# EAGLE design shema (EAGLE 9.6.2)
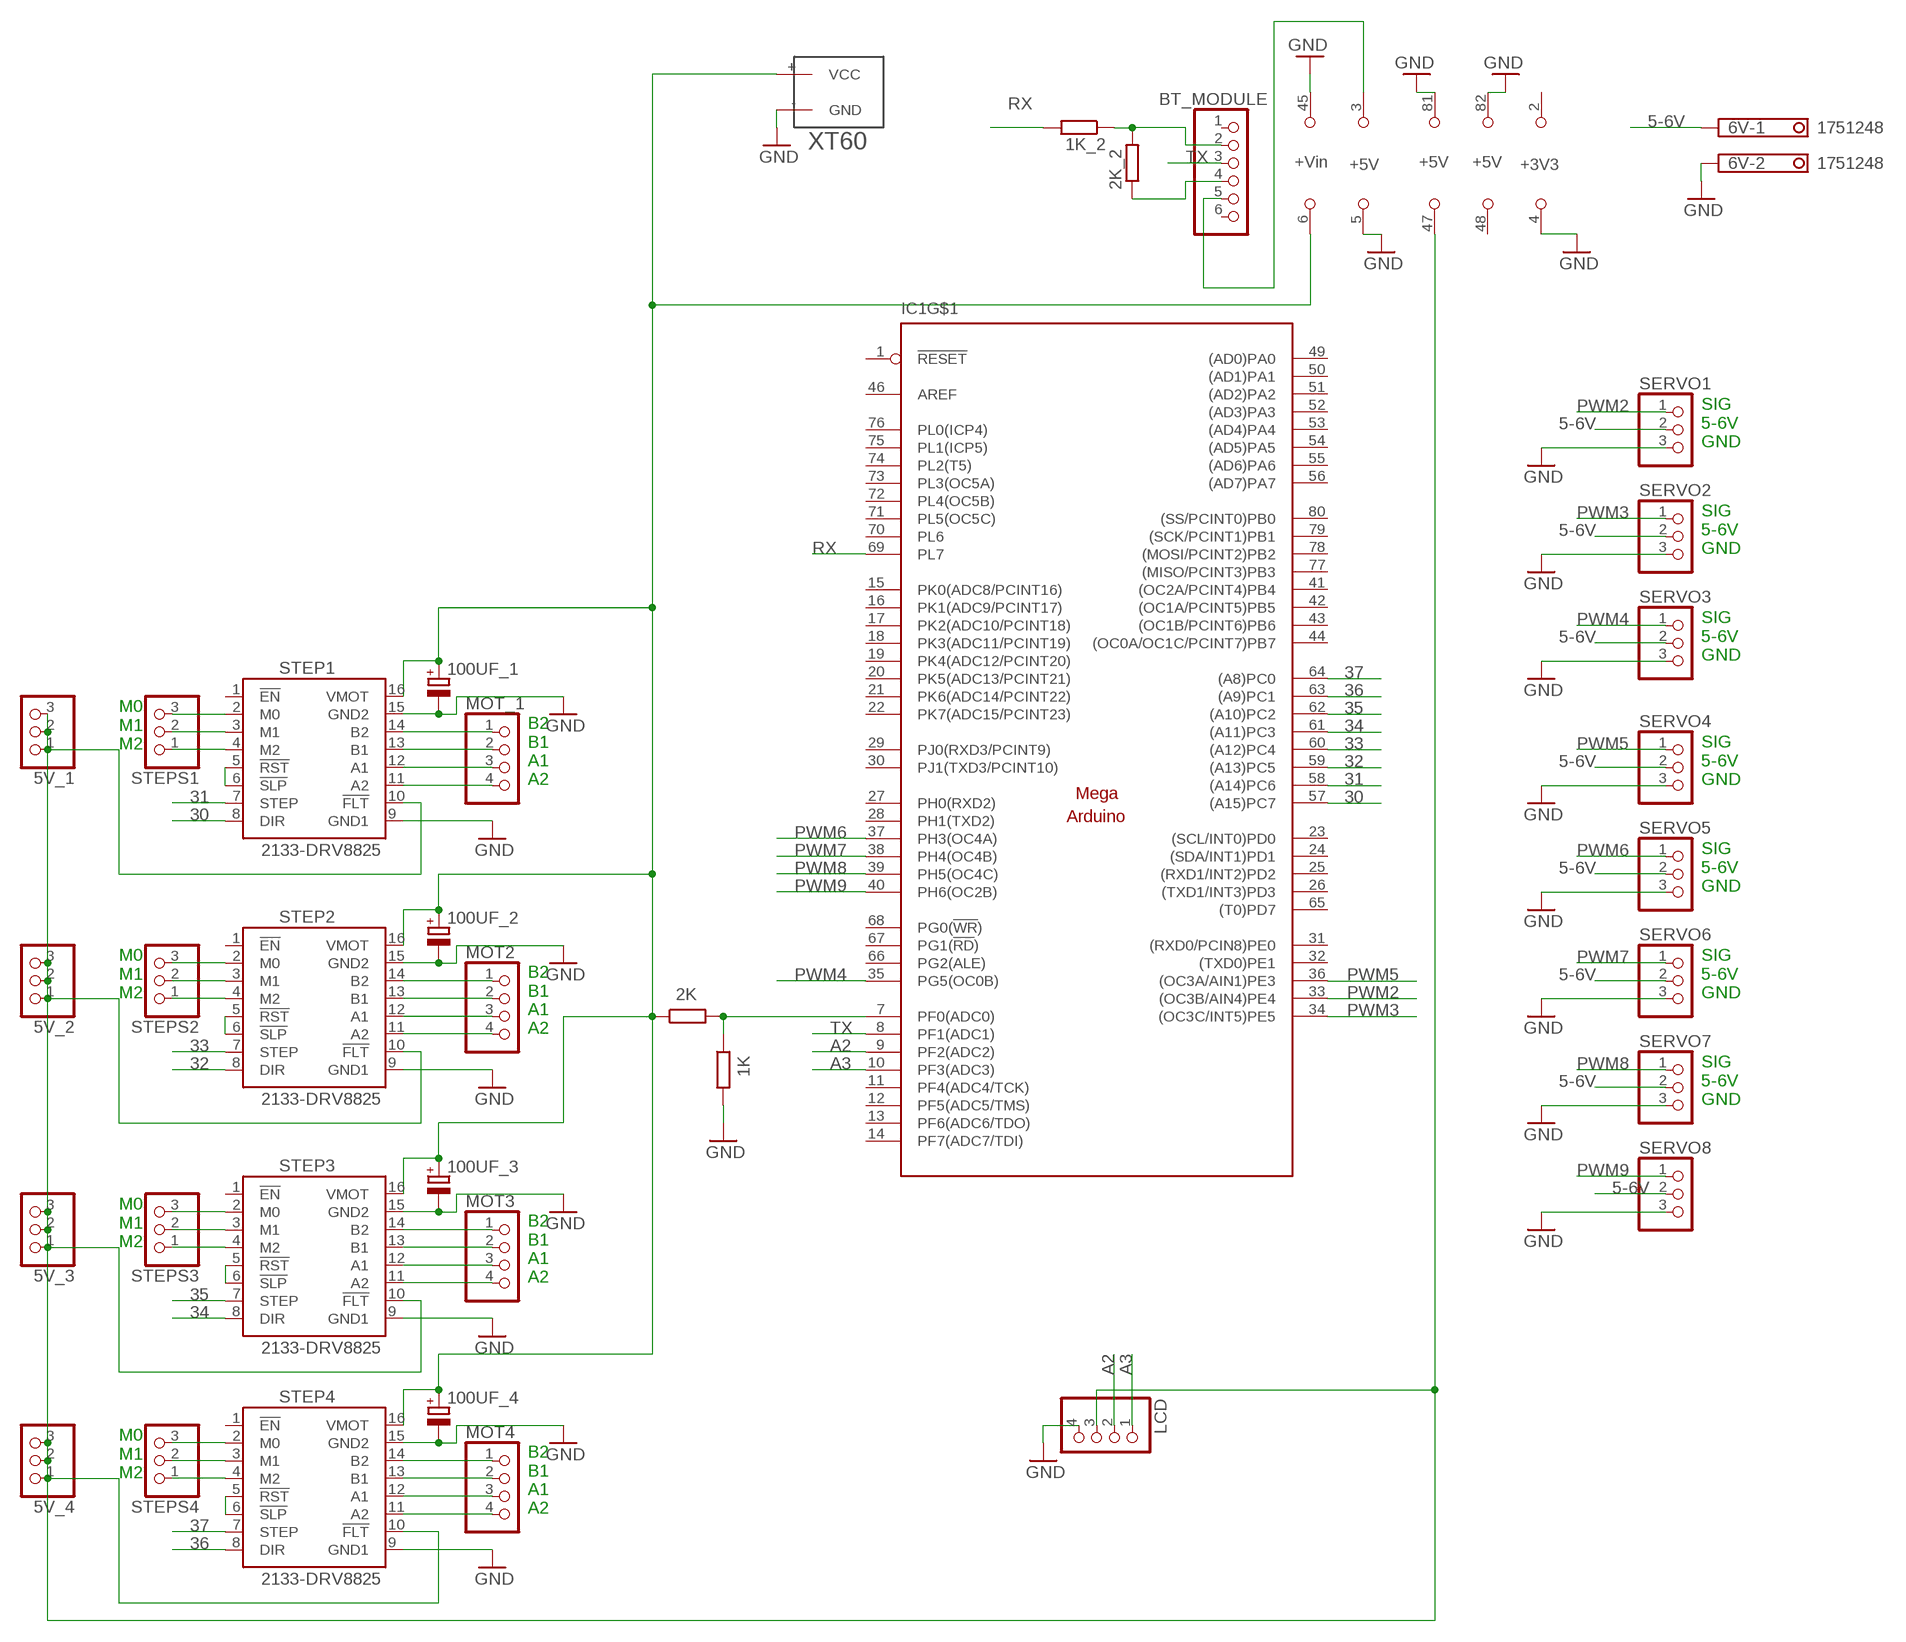
[diagram p0: schematic, sheet 1]

## Parts
1K  R-EU_0204/7  [0204/7]
1K_2  R-EU_0204/7  [0204/7]
2K  R-EU_0204/7  [0204/7]
2K_2  R-EU_0204/7  [0204/7]
5V_1  PINHD-1X3  [1X03]
5V_2  PINHD-1X3  [1X03]
5V_3  PINHD-1X3  [1X03]
5V_4  PINHD-1X3  [1X03]
6V  1751248  [1751248]
100UF_1  CPOL-EUE5-5  [E5-5]
100UF_2  CPOL-EUE5-5  [E5-5]
100UF_3  CPOL-EUE5-5  [E5-5]
100UF_4  CPOL-EUE5-5  [E5-5]
BT_MODULE  PINHD-1X6  [1X06]
IC1  MEGAARDUINO_22  [MEGA_ARDUINO_2]
LCD  PINHD-1X4  [1X04]
MOT2  PINHD-1X4  [1X04]
MOT3  PINHD-1X4  [1X04]
MOT4  PINHD-1X4  [1X04]
MOT_1  PINHD-1X4  [1X04]
SERVO1  PINHD-1X3  [1X03]
SERVO2  PINHD-1X3  [1X03]
SERVO3  PINHD-1X3  [1X03]
SERVO4  PINHD-1X3  [1X03]
SERVO5  PINHD-1X3  [1X03]
SERVO6  PINHD-1X3  [1X03]
SERVO7  PINHD-1X3  [1X03]
SERVO8  PINHD-1X3  [1X03]
STEP1  2133-DRV8825  [DRV8825]
STEP2  2133-DRV8825  [DRV8825]
STEP3  2133-DRV8825  [DRV8825]
STEP4  2133-DRV8825  [DRV8825]
STEPS1  PINHD-1X3  [1X03]
STEPS2  PINHD-1X3  [1X03]
STEPS3  PINHD-1X3  [1X03]
STEPS4  PINHD-1X3  [1X03]
U$1  XT60  [XT60]

## Nets
5-6V [ALL]: 6V.1 SERVO1.2 SERVO2.2 SERVO3.2 SERVO4.2 SERVO5.2 SERVO6.2 SERVO7.2 SERVO8.2
12V1 [12V]: 2K.1 100UF_1.+ 100UF_2.+ 100UF_3.+ 100UF_4.+ IC1.6(+VIN) STEP1.16(VMOT) STEP2.16(VMOT) STEP3.16(VMOT) STEP4.16(VMOT) U$1.+(VCC)
30 [ALL]: IC1.57((A15)PC7) STEP1.8(DIR)
31 [ALL]: IC1.58((A14)PC6) STEP1.7(STEP)
32 [ALL]: IC1.59((A13)PC5) STEP2.8(DIR)
33 [ALL]: IC1.60((A12)PC4) STEP2.7(STEP)
34 [ALL]: IC1.61((A11)PC3) STEP3.8(DIR)
35 [ALL]: IC1.62((A10)PC2) STEP3.7(STEP)
36 [ALL]: IC1.63((A9)PC1) STEP4.8(DIR)
37 [ALL]: IC1.64((A8)PC0) STEP4.7(STEP)
A2 [ALL]: IC1.9(PF2(ADC2)) LCD.2
A3 [ALL]: IC1.10(PF3(ADC3)) LCD.1
GND [ALL]: 1K.2 6V.2 100UF_1.- 100UF_2.- 100UF_3.- 100UF_4.- IC1.4(GND) IC1.5(GND) IC1.45(GND) IC1.81(GND) IC1.82(GND) LCD.4 SERVO1.3 SERVO2.3 SERVO3.3 SERVO4.3 SERVO5.3 SERVO6.3 SERVO7.3 SERVO8.3 STEP1.9(GND1) STEP1.15(GND2) STEP2.9(GND1) STEP2.15(GND2) STEP3.9(GND1) STEP3.15(GND2) STEP4.9(GND1) STEP4.15(GND2) U$1.-(GND)
N$1 [ALL]: 1K.1 2K.2 IC1.7(PF0(ADC0))
N$2 [ALL]: MOT_1.1 STEP1.14(B2)
N$3 [ALL]: MOT_1.2 STEP1.13(B1)
N$4 [ALL]: MOT_1.3 STEP1.12(A1)
N$5 [ALL]: MOT_1.4 STEP1.11(A2)
N$6 [ALL]: MOT2.1 STEP2.14(B2)
N$7 [ALL]: MOT2.2 STEP2.13(B1)
N$8 [ALL]: MOT2.3 STEP2.12(A1)
N$9 [ALL]: MOT2.4 STEP2.11(A2)
N$10 [ALL]: MOT3.1 STEP3.14(B2)
N$11 [ALL]: MOT3.2 STEP3.13(B1)
N$12 [ALL]: MOT3.3 STEP3.12(A1)
N$13 [ALL]: MOT3.4 STEP3.11(A2)
N$14 [ALL]: MOT4.1 STEP4.14(B2)
N$15 [ALL]: MOT4.2 STEP4.13(B1)
N$16 [ALL]: MOT4.3 STEP4.12(A1)
N$17 [ALL]: MOT4.4 STEP4.11(A2)
N$18 [ALL]: STEP1.2(M0) STEPS1.3
N$19 [ALL]: 2K_2.1 BT_MODULE.4
N$20 [ALL]: 1K_2.1 2K_2.2 BT_MODULE.2
N$21 [ALL]: BT_MODULE.5 IC1.3(+5V)
N$22 [ALL]: STEP1.3(M1) STEPS1.2
N$23 [ALL]: STEP1.4(M2) STEPS1.1
N$24 [ALL]: STEP2.2(M0) STEPS2.3
N$25 [ALL]: STEP2.3(M1) STEPS2.2
N$26 [ALL]: STEP2.4(M2) STEPS2.1
N$27 [ALL]: STEP3.2(M0) STEPS3.3
N$28 [ALL]: STEP3.3(M1) STEPS3.2
N$29 [ALL]: STEP3.4(M2) STEPS3.1
N$30 [ALL]: STEP4.2(M0) STEPS4.3
N$31 [ALL]: STEP4.3(M1) STEPS4.2
N$32 [ALL]: STEP4.4(M2) STEPS4.1
N$33 [ALL]: STEP1.5(!RST) STEP1.6(!SLP)
N$34 [ALL]: STEP2.5(!RST) STEP2.6(!SLP)
N$35 [ALL]: STEP3.5(!RST) STEP3.6(!SLP)
N$36 [ALL]: STEP4.5(!RST) STEP4.6(!SLP)
N$37 [ALL]: 5V_1.1 5V_1.2 5V_1.3 5V_2.1 5V_2.2 5V_2.3 5V_3.1 5V_3.2 5V_3.3 5V_4.1 5V_4.2 5V_4.3 IC1.47(+5V) LCD.3 STEP1.10(!FLT) STEP2.10(!FLT) STEP3.10(!FLT) STEP4.10(!FLT)
PWM2 [ALL]: IC1.33((OC3B/AIN4)PE4) SERVO1.1
PWM3 [ALL]: IC1.34((OC3C/INT5)PE5) SERVO2.1
PWM4 [ALL]: IC1.35(PG5(OC0B)) SERVO3.1
PWM5 [ALL]: IC1.36((OC3A/AIN1)PE3) SERVO4.1
PWM6 [ALL]: IC1.37(PH3(OC4A)) SERVO5.1
PWM7 [ALL]: IC1.38(PH4(OC4B)) SERVO6.1
PWM8 [ALL]: IC1.39(PH5(OC4C)) SERVO7.1
PWM9 [ALL]: IC1.40(PH6(OC2B)) SERVO8.1
RX [ALL]: 1K_2.2 IC1.69(PL7)
TX [ALL]: BT_MODULE.3 IC1.8(PF1(ADC1))
Unconnected: BT_MODULE.1 BT_MODULE.6 IC1.1(!RESET) IC1.11(PF4(ADC4/TCK)) IC1.12(PF5(ADC5/TMS)) IC1.13(PF6(ADC6/TDO)) IC1.14(PF7(ADC7/TDI)) IC1.15(PK0(ADC8/PCINT16)) IC1.16(PK1(ADC9/PCINT17)) IC1.17(PK2(ADC10/PCINT18)) IC1.18(PK3(ADC11/PCINT19)) IC1.19(PK4(ADC12/PCINT20)) IC1.20(PK5(ADC13/PCINT21)) IC1.21(PK6(ADC14/PCINT22)) IC1.22(PK7(ADC15/PCINT23)) IC1.23((SCL/INT0)PD0) IC1.24((SDA/INT1)PD1) IC1.25((RXD1/INT2)PD2) IC1.26((TXD1/INT3)PD3) IC1.27(PH0(RXD2)) IC1.28(PH1(TXD2)) IC1.29(PJ0(RXD3/PCINT9)) IC1.30(PJ1(TXD3/PCINT10)) IC1.31((RXD0/PCIN8)PE0) IC1.32((TXD0)PE1) IC1.41((OC2A/PCINT4)PB4) IC1.42((OC1A/PCINT5)PB5) IC1.43((OC1B/PCINT6)PB6) IC1.44((OC0A/OC1C/PCINT7)PB7) IC1.46(AREF) IC1.49((AD0)PA0) IC1.50((AD1)PA1) IC1.51((AD2)PA2) IC1.52((AD3)PA3) IC1.53((AD4)PA4) IC1.54((AD5)PA5) IC1.55((AD6)PA6) IC1.56((AD7)PA7) IC1.65((T0)PD7) IC1.66(PG2(ALE)) IC1.67(PG1(!RD!)) IC1.68(PG0(!WR!)) IC1.70(PL6) IC1.71(PL5(OC5C)) IC1.72(PL4(OC5B)) IC1.73(PL3(OC5A)) IC1.74(PL2(T5)) IC1.75(PL1(ICP5)) IC1.76(PL0(ICP4)) IC1.77((MISO/PCINT3)PB3) IC1.78((MOSI/PCINT2)PB2) IC1.79((SCK/PCINT1)PB1) IC1.80((SS/PCINT0)PB0) STEP1.1(!EN) STEP2.1(!EN) STEP3.1(!EN) STEP4.1(!EN)

## Notes on the sheet
- SIG
  5-6V
  GND
- SIG
  5-6V
  GND
- SIG
  5-6V
  GND
- M0
  M1
  M2
- B2
  B1
  A1
  A2
- SIG
  5-6V
  GND
- SIG
  5-6V
  GND
- M0
  M1
  M2
- SIG
  5-6V
  GND
- B2
  B1
  A1
  A2
- SIG
  5-6V
  GND
- M0
  M1
  M2
- B2
  B1
  A1
  A2
- M0
  M1
  M2
- B2
  B1
  A1
  A2

## Power pins joined to a net without a drawn wire
+3V3: IC1.2(+3V3)
+5V: IC1.48(+5V)

## Library data of the parts
1K 1K_2 2K 2K_2 = rcl:R-EU_: RESISTOR, European symbol; SPICEPREFIX: R
5V_1-5V_4 SERVO1-SERVO8 STEPS1-STEPS4 = pinhead:PINHD-1X3: PIN HEADER
6V = con-phoenix-350:1751248: MKDS 1/ 2-3,5 Printklemme Nennstrom: 10 A Bemessungsspannung: 160 V Raster: 3,5 mm Polzahl: 2 Montageart: Löten Anschlussart: Schraubanschluss Anschlussrichtung vom Leiter zur Platine: 0° Source: http://eshop.phoenixcontact.com .. 1751248.pdf; OC_FARNELL: unknown; OC_NEWARK: unknown
100UF_1-100UF_4 = rcl:CPOL-EU: POLARIZED CAPACITOR, European symbol; SPICEPREFIX: C
BT_MODULE = pinhead:PINHD-1X6: PIN HEADER
IC1 = arduino:MEGAARDUINO_2: The Arduino Mega is a microcontroller board based on the ATmega1280. - 54 digital input/output pins (of which 14 can be used as PWM outputs) - 16 analog inputs - 4 UARTs (hardware serial ports) - 16 MHz crystal oscillator - USB connection - power jack - ICSP header - reset button It contains everything needed to support the microcontroller; simply connect it to a computer with a USB cable or power it with a AC-to-DC adapter or battery to get started. The Mega is compatible with most shields designed for the Arduino Duemilanove or Diecimila. http://arduino.cc/en/Main/ArduinoBoardMega
LCD MOT2-MOT4 MOT_1 = pinhead:PINHD-1X4: PIN HEADER
STEP1-STEP4 = pololu-stepper-driver:2133-DRV8825: DRV8825 Stepper Motor Driver Carrier, High Current #2133 DRV8825 Stepper Motor Driver Carrier; High Current <https://www.pololu.com/product/2133> in Japan, Suzaku Lab. Ltd. <https://suzakugiken.jp/> #2133 DRV8825 大電流用ステッピングモータドライバ <https://szc.jp/po2133>
U$1 = XT60:XT60: XT60

## Net classes
1 12V: width 1.27 mm, clearance 0.127 mm
2 ALL: width 0.508 mm, clearance 0.127 mm

## Board
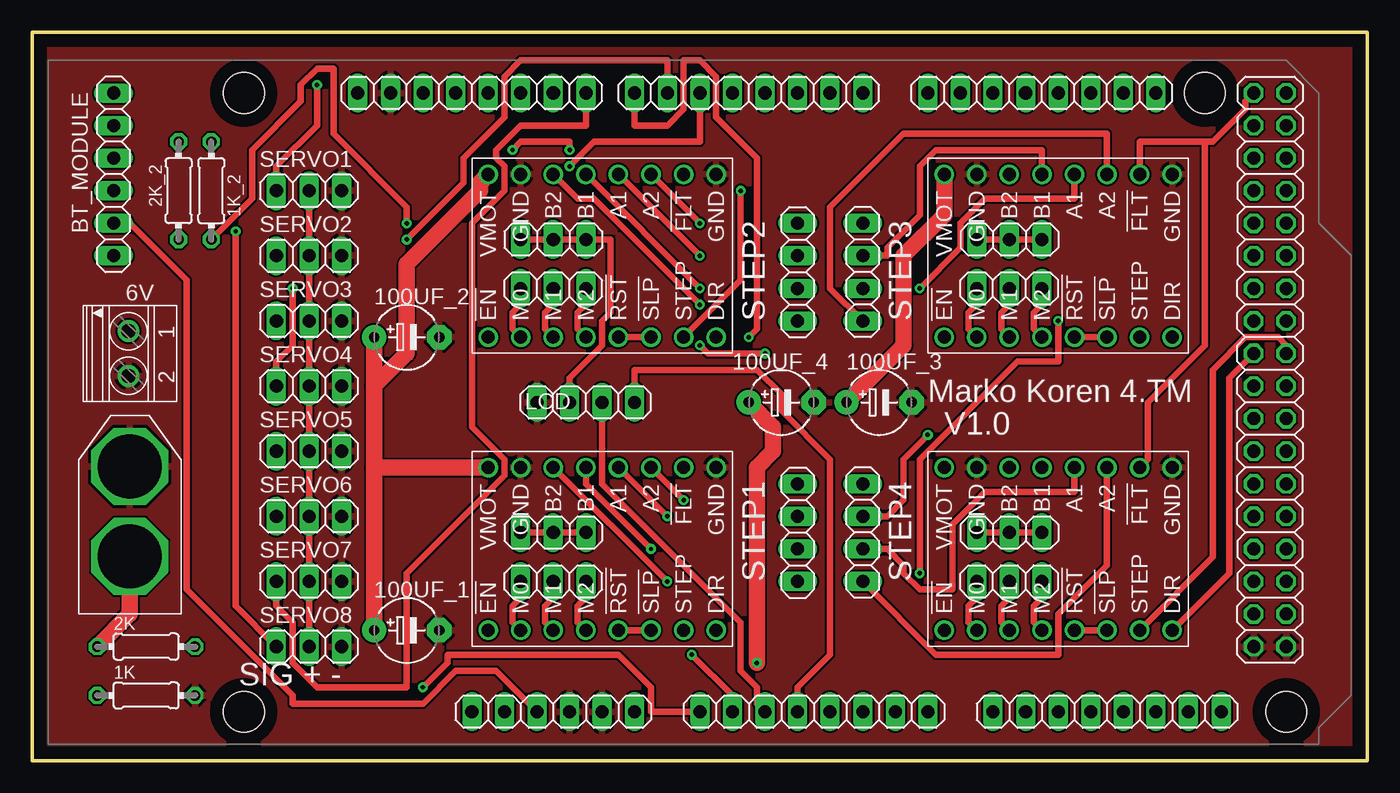
[diagram p1: board, top side]
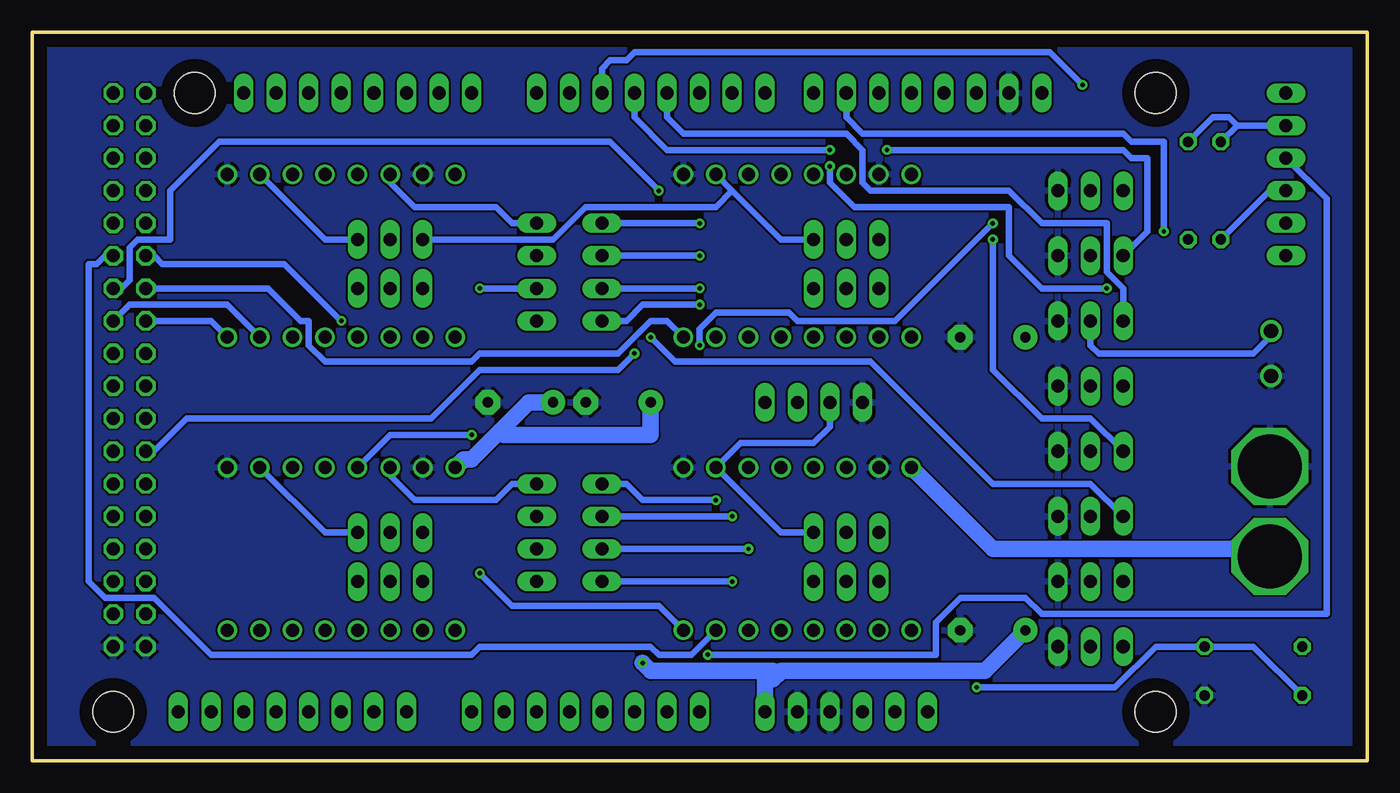
[diagram p2: board, bottom side, seen from below]

Size 104.12 x 56.82 mm. Coordinates in mm from the lower left corner, seen from the top.
Outline: 0,0 104.12,0 104.12,56.82 0,56.82 0,0
Copper layers (1*16): Top 0.035mm / dielectric 1.5mm / Bottom 0.035mm
Design rules "default": minimum track width 6mil, minimum drill 0.35mm, track to track 6mil, track to pad 6mil, pad to pad 6mil, via to via 6mil, smd to smd 6mil, copper to edge 40mil, drill to drill 6mil, minimum pad ring 10mil, minimum via ring 8mil, stop-mask expansion 4mil, vias tented up to drill 0mil, thermal gap 10mil

### Footprints (pad centres in the part's own frame; a part is rotated, then mirrored left to right if it is on the bottom)
0204/7 = drill 0.813 octagon: 1 -3.81,0; 2 3.81,0
1X03 = drill 1.016 long: 1 -2.54,0; 2 0,0; 3 2.54,0
1751248 = drill 1.1 pad 1.7: 1 -1.75,-0.1; 2 1.75,-0.1
E5-5 = drill 0.813 pad 1.905: + -2.54,0 | drill 0.813 pad 1.905 octagon: - 2.54,0
1X06 = drill 1.016 long: 1 -6.35,0; 2 -3.81,0; 3 -1.27,0; 4 1.27,0; 5 3.81,0; 6 6.35,0
MEGA_ARDUINO_2 = drill 1.016 long: 1 33.02,2.54; 2 35.56,2.54; 3 38.1,2.54; 4 40.64,2.54; 5 43.18,2.54; 6 45.72,2.54; 7 50.8,2.54; 8 53.34,2.54; 9 55.88,2.54; 10 58.42,2.54; 11 60.96,2.54; 12 63.5,2.54; 13 66.04,2.54; 14 68.58,2.54; 15 73.66,2.54; 16 76.2,2.54; 17 78.74,2.54; 18 81.28,2.54; 19 83.82,2.54; 20 86.36,2.54; 21 88.9,2.54; 22 91.44,2.54; 23 86.36,50.8; 24 83.82,50.8; 25 81.28,50.8; 26 78.74,50.8; 27 76.2,50.8; 28 73.66,50.8; 29 71.12,50.8; 30 68.58,50.8; 31 63.5,50.8; 32 60.96,50.8; 33 58.42,50.8; 34 55.88,50.8; 35 53.34,50.8; 36 50.8,50.8; 37 48.26,50.8; 38 45.72,50.8; 39 41.91,50.8; 40 39.37,50.8; 41 36.83,50.8; 42 34.29,50.8; 43 31.75,50.8; 44 29.21,50.8; 45 26.67,50.8; 46 24.13,50.8 | drill 1.016 octagon: 47 93.98,50.8; 48 96.52,50.8; 49 93.98,48.26; 50 96.52,48.26; 51 93.98,45.72; 52 96.52,45.72; 53 93.98,43.18; 54 96.52,43.18; 55 93.98,40.64; 56 96.52,40.64; 57 93.98,38.1; 58 96.52,38.1; 59 93.98,35.56; 60 96.52,35.56; 61 93.98,33.02; 62 96.52,33.02; 63 93.98,30.48; 64 96.52,30.48; 65 93.98,27.94; 66 96.52,27.94; 67 93.98,25.4; 68 96.52,25.4; 69 93.98,22.86; 70 96.52,22.86; 71 93.98,20.32; 72 96.52,20.32; 73 93.98,17.78; 74 96.52,17.78; 75 93.98,15.24; 76 96.52,15.24; 77 93.98,12.7; 78 96.52,12.7; 79 93.98,10.16; 80 96.52,10.16; 81 93.98,7.62; 82 96.52,7.62 | hole 3.2: 15.24,50.8; 15.24,2.54; 90.17,50.8; 96.52,2.54
1X04 = drill 1.016 long: 1 -3.81,0; 2 -1.27,0; 3 1.27,0; 4 3.81,0
DRV8825 = drill 1.016: 1 -6.35,8.89; 2 -6.35,6.35; 3 -6.35,3.81; 4 -6.35,1.27; 5 -6.35,-1.27; 6 -6.35,-3.81; 7 -6.35,-6.35; 8 -6.35,-8.89; 9 6.35,-8.89; 10 6.35,-6.35; 11 6.35,-3.81; 12 6.35,-1.27; 13 6.35,1.27; 14 6.35,3.81; 15 6.35,6.35; 16 6.35,8.89
XT60 = drill 5 octagon: + 4.5,0; - 11.5,0

### Placement (x,y rotation side)
1K  8.89,5.08 0 top
1K_2  13.97,44.45 270 top
2K  8.89,8.89 0 top
2K_2  11.43,44.45 90 top
5V_1  40.64,17.78 0 top
5V_2  76.2,17.78 0 top
5V_3  76.2,40.64 0 top
5V_4  40.64,40.64 0 top
6V  7.62,31.75 270 top
100UF_1  29.21,10.16 0 top
100UF_2  29.21,33.02 0 top
100UF_3  66.04,27.94 0 top
100UF_4  58.42,27.94 0 top
BT_MODULE  6.35,45.72 270 top
IC1  1.27,1.27 0 top
LCD  43.18,27.94 180 top
MOT2  59.69,38.1 90 top
MOT3  64.77,38.1 270 top
MOT4  64.77,17.78 270 top
MOT_1  59.69,17.78 90 top
SERVO1  21.59,44.45 0 top
SERVO2  21.59,39.37 0 top
SERVO3  21.59,34.29 0 top
SERVO4  21.59,29.21 0 top
SERVO5  21.59,24.13 0 top
SERVO6  21.59,19.05 0 top
SERVO7  21.59,13.97 0 top
SERVO8  21.59,8.89 0 top
STEP1  44.45,16.51 90 top
STEP2  44.45,39.37 90 top
STEP3  80.01,39.37 90 top
STEP4  80.01,16.51 90 top
STEPS1  40.64,13.97 180 top
STEPS2  40.64,36.83 180 top
STEPS3  76.2,36.83 180 top
STEPS4  76.2,13.97 180 top
U$1  7.62,11.43 90 top

### Tracks (layer width: path | path; a pad name or v marks a point on that pad's centre or on a via)
5-6V
  Top 0.508: SERVO8.2 SERVO7.2 SERVO6.2 SERVO5.2 SERVO4.2 SERVO3.2 SERVO2.2 SERVO1.2
  Bottom 0.508: SERVO3.2 21.59,32.38 20.95,31.75 8.89,31.75 7.62,33.02 6V.1
12V1  (via drill 0.35)
  Top 1.27: STEP3.16 71.12,42.55 67.94,39.37 67.94,32.38 100UF_3.+ | 2K.1 7.62,11.43 U$1.+ | 26.67,22.86 STEP1.16 | 100UF_2.+ 26.67,29.21 | 26.67,29.21 26.67,22.86 | STEP2.16 34.93,45.08 34.93,44.45 29.21,38.73 29.21,31.75 26.67,29.21 | 26.67,22.86 100UF_1.+ | 100UF_4.+ 57.79,26.04 57.79,24.13 56.52,22.86 v56.52,7.62
  Bottom 1.27: STEP4.16 70.49,23.49 69.85,23.49 67.63,25.72 | 67.63,25.72 65.41,27.94 100UF_3.+ | 100UF_4.+ 55.88,25.4 67.31,25.4 67.63,25.72 | IC1.6 46.99,6.35 46.35,6.35 46.04,6.67 | 46.04,6.67 45.72,6.98 29.85,6.98 100UF_1.+ | STEP1.16 29.21,16.51 7.62,16.51 U$1.+ | v56.52,7.62 55.88,6.98 46.35,6.98 46.04,6.67
30  (via drill 0.35)
  Top 0.508: v69.22,14.61 69.22,23.49 76.84,31.12 80.01,31.12 v80.01,34.29
  Bottom 0.508: STEP1.8 55.24,12.06 66.68,12.06 v69.22,14.61 | v80.01,34.29 84.46,38.73 93.98,38.73 94.62,39.37 IC1.57
31
  Bottom 0.508: STEP1.7 52.71,8.25 55.24,8.25 55.88,8.89 69.22,8.89 69.85,8.25 90.17,8.25 94.62,12.7 98.43,12.7 99.7,13.97 99.7,38.73 99.06,38.73 98.43,39.37 IC1.58
32
  Bottom 0.508: STEP2.8 54.61,34.29 55.88,34.29 58.42,31.75 69.22,31.75 69.85,31.12 81.28,31.12 82.55,32.38 82.55,34.29 83.19,34.29 85.72,36.83 IC1.59
33  (via drill 0.35)
  Top 0.508: STEP2.7 55.24,37.47 v55.24,44.45
  Bottom 0.508: v55.24,44.45 59.05,48.26 89.53,48.26 93.34,44.45 93.34,40.64 95.89,40.64 96.52,40.01 96.52,37.47 97.16,36.83 IC1.60
34
  Bottom 0.508: STEP3.8 90.17,34.29 IC1.61
35
  Bottom 0.508: STEP3.7 88.9,35.56 96.52,35.56 IC1.62
36
  Top 0.508: STEP4.8 93.34,14.61 93.34,29.84 IC1.63
37
  Top 0.508: STEP4.7 92.07,15.88 92.07,30.48 94.62,33.02 97.16,33.02 97.79,32.38 IC1.64
A2
  Top 0.508: IC1.9 56.52,4.45 56.52,5.71 55.24,6.98 55.24,10.8 44.45,21.59 LCD.2
A3
  Top 0.508: IC1.10 59.69,5.71 62.23,8.25 62.23,23.49 58.42,27.3 58.42,28.58 56.52,30.48 46.99,30.48 LCD.1
GND
  pour Top: -1.27,59.69 106.68,59.69 106.68,-2.54 -2.54,-2.54 -2.54,59.69
  pour Bottom: -2.54,59.69 106.68,59.69 106.68,-2.54 -2.54,-2.54
N$1  (via drill 0.35)
  Top 0.508: IC1.7 48.26,3.81 48.26,5.71 45.72,8.25 32.38,8.25 32.38,7.62 v30.48,5.71
  Bottom 0.508: 1K.1 8.89,8.89 2K.2 16.51,8.89 19.69,5.71 v30.48,5.71
N$2  (via drill 0.35)
  Top 0.508: v49.53,13.97 STEP1.14
  Bottom 0.508: MOT_1.1 v49.53,13.97
N$3  (via drill 0.35)
  Top 0.508: STEP1.13 43.18,21.59 v48.26,16.51
  Bottom 0.508: MOT_1.2 v48.26,16.51
N$4  (via drill 0.35)
  Top 0.508: v49.53,19.05 STEP1.12
  Bottom 0.508: MOT_1.3 v49.53,19.05
N$5  (via drill 0.35)
  Top 0.508: v50.8,20.32 STEP1.11
  Bottom 0.508: v50.8,20.32 56.52,20.32 57.79,21.59 MOT_1.4
N$6  (via drill 0.35)
  Top 0.508: STEP2.14 42.54,43.81 43.82,43.81 v52.07,35.56
  Bottom 0.508: v52.07,35.56 56.52,35.56 57.79,34.29 MOT2.1
N$7  (via drill 0.35)
  Top 0.508: v52.07,36.83 STEP2.13
  Bottom 0.508: MOT2.2 v52.07,36.83
N$8  (via drill 0.35)
  Top 0.508: v52.07,39.37 STEP2.12
  Bottom 0.508: MOT2.3 v52.07,39.37
N$9  (via drill 0.35)
  Top 0.508: v52.07,41.91 STEP2.11
  Bottom 0.508: MOT2.4 v52.07,41.91
N$10
  Bottom 0.508: MOT3.1 66.68,41.91 67.94,43.18 74.29,43.18 76.2,45.08 STEP3.14
N$11
  Top 0.508: MOT3.2 66.68,39.37 66.68,40.01 69.22,42.55 69.22,46.36 70.49,47.62 78.74,47.62 STEP3.13
N$12  (via drill 0.35)
  Top 0.508: v69.22,36.83 72.39,40.01 72.39,41.91 74.29,43.81 81.28,43.81 STEP3.12
  Bottom 0.508: v69.22,36.83 MOT3.3
N$13
  Top 0.508: MOT3.4 62.23,36.83 62.23,43.18 67.94,48.89 83.82,48.89 STEP3.11
N$14
  Bottom 0.508: MOT4.1 66.68,21.59 67.94,20.32 74.29,20.32 76.2,22.23 STEP4.14
N$15  (via drill 0.35)
  Top 0.508: MOT4.2 66.68,19.05 67.94,20.32 67.94,23.49 v69.85,25.4
  Bottom 0.508: v69.85,25.4 76.2,25.4 STEP4.13
N$16
  Top 0.508: MOT4.3 66.68,16.51 67.94,15.24 67.94,14.61 69.22,13.34 71.75,13.34 71.75,18.41 74.29,20.95 81.28,20.95 STEP4.12
N$17
  Top 0.508: MOT4.4 70.49,8.25 80.01,8.25 80.01,11.43 83.82,15.24 STEP4.11
N$18
  Top 0.508: STEP1.2 37.46,10.8 37.46,12.06 38.1,12.7 STEPS1.3
N$19
  Bottom 0.508: 2K_2.1 7.62,44.45 BT_MODULE.4
N$20
  Bottom 0.508: 10.16,49.53 2K_2.2 | BT_MODULE.2 10.16,49.53 | 1K_2.1 12.06,50.17 10.8,50.17 10.16,49.53
N$21
  Top 0.508: IC1.3 36.2,6.98 33.02,6.98 30.48,4.45 20.32,4.45 20.32,5.08 12.06,13.34 12.06,37.47 7.62,41.91 BT_MODULE.5
N$22
  Top 0.508: STEP1.3 40.01,10.8 40.01,12.06 40.64,12.7 STEPS1.2
N$23
  Top 0.508: STEP1.4 42.54,10.8 42.54,12.06 43.18,12.7 STEPS1.1
N$24
  Top 0.508: STEP2.2 37.46,33.66 37.46,34.92 38.1,35.56 STEPS2.3
N$25
  Top 0.508: STEP2.3 40.01,33.66 40.01,34.92 40.64,35.56 STEPS2.2
N$26
  Top 0.508: STEP2.4 42.54,33.66 42.54,34.92 43.18,35.56 STEPS2.1
N$27
  Top 0.508: STEP3.2 73.03,33.66 73.03,34.92 73.66,35.56 STEPS3.3
N$28
  Top 0.508: STEP3.3 75.56,33.66 75.56,34.92 76.2,35.56 STEPS3.2
N$29
  Top 0.508: STEP3.4 78.1,33.66 78.1,34.92 78.74,35.56 STEPS3.1
N$30
  Top 0.508: STEP4.2 73.03,10.8 73.03,12.06 73.66,12.7 STEPS4.3
N$31
  Top 0.508: STEP4.3 75.56,10.8 75.56,12.06 76.2,12.7 STEPS4.2
N$32
  Top 0.508: STEP4.4 78.1,10.8 78.1,12.06 78.74,12.7 STEPS4.1
N$33
  Top 0.508: STEP1.6 STEP1.5
N$34
  Top 0.508: STEP2.6 STEP2.5
N$35
  Top 0.508: STEP3.6 STEP3.5
N$36
  Top 0.508: STEP4.6 STEP4.5
N$37
  Top 0.508: 5V_4.1 5V_4.2 5V_4.3 45.09,40.64 45.09,34.92 44.45,34.29 44.45,32.38 41.91,29.84 LCD.3 | 5V_1.1 5V_1.2 5V_1.3 | 5V_2.1 5V_2.2 5V_2.3 | 5V_3.1 5V_3.2 5V_3.3 | IC1.47 94.62,51.44 94.62,50.8 92.07,48.26 91.44,48.26 | 91.44,48.26 86.36,48.26 STEP3.10 | STEP4.10 87,23.49 87,27.94 91.44,32.38 91.44,48.26
  Bottom 0.508: 49.53,44.45 45.72,40.64 5V_4.3 | 49.53,44.45 STEP2.10 | 5V_1.3 45.72,17.78 STEP1.10 48.9,24.77 43.18,24.77 41.91,26.04 LCD.3 | STEP4.10 81.28,17.78 5V_2.3 | STEP3.10 81.28,40.64 5V_3.3 | 49.53,44.45 50.8,43.18 60.96,43.18 63.5,40.64 5V_3.1
PWM2  (via drill 0.35)
  Top 0.508: SERVO1.1 19.05,46.36 22.23,49.53 v22.23,52.7
  Bottom 0.508: v22.23,52.7 24.77,55.25 57.15,55.25 57.79,54.61 59.05,54.61 59.69,53.97 IC1.33
PWM3  (via drill 0.35)
  Top 0.508: v37.46,47.62 38.1,48.26 41.91,48.26 v41.91,47.62
  Bottom 0.508: SERVO2.1 17.15,41.28 17.15,46.99 18.41,46.99 19.05,47.62 v37.46,47.62 | v41.91,47.62 54.61,47.62 57.15,50.17 IC1.34
PWM4
  Bottom 0.508: SERVO3.1 19.05,36.83 20.32,38.1 20.32,41.91 25.4,41.91 27.94,44.45 38.74,44.45 39.37,45.08 39.37,47.62 40.64,48.89 53.34,48.89 54.61,50.17 IC1.35
PWM5  (via drill 0.35)
  Top 0.508: SERVO4.1 19.05,31.12 20.32,32.38 v20.32,36.83 | v41.91,46.36 43.82,48.26 52.07,48.26 IC1.36
  Bottom 0.508: v20.32,36.83 25.4,36.83 27.94,39.37 27.94,43.18 40.01,43.18 41.91,45.08 v41.91,46.36
PWM6  (via drill 0.35)
  Top 0.508: v29.21,40.64 33.65,45.08 33.65,46.99 36.83,50.17 36.83,53.34 38.1,54.61 49.53,54.61 IC1.37
  Bottom 0.508: SERVO5.1 21.59,26.67 25.4,26.67 29.21,30.48 v29.21,40.64
PWM7  (via drill 0.35)
  Top 0.508: v55.88,33.02 56.52,33.66 56.52,46.99 53.34,50.17 53.34,53.34 52.07,54.61 50.8,54.61 50.8,50.8 49.53,49.53 46.99,49.53 IC1.38
  Bottom 0.508: SERVO6.1 21.59,21.59 29.21,21.59 38.74,31.12 53.98,31.12 v55.88,33.02
PWM8
  Top 0.508: SERVO7.1 19.05,12.06 20.32,10.8 20.32,7.62 22.23,5.71 29.21,5.71 29.21,14.61 36.83,22.23 36.83,23.49 34.29,26.04 34.29,41.91 36.83,44.45 36.83,46.36 36.2,46.99 36.2,47.62 38.1,49.53 43.18,49.53 IC1.39
PWM9  (via drill 0.35)
  Top 0.508: SERVO8.1 15.88,12.06 v15.88,41.28
  Bottom 0.508: v15.88,41.28 15.88,48.26 18.41,48.26 19.05,48.89 39.37,48.89 40.64,50.17 IC1.40
RX  (via drill 0.35)
  Top 0.508: 1K_2.2 17.15,43.81 17.15,47.62 20.95,51.44 20.95,52.7 22.23,53.97 23.49,53.97 23.49,48.89 29.21,43.18 v29.21,41.91 | v52.07,32.38 52.71,31.75 v57.15,31.75
  Bottom 0.508: v29.21,41.91 36.83,34.29 44.45,34.29 45.09,34.92 50.8,34.92 52.07,33.66 v52.07,32.38 | v57.15,31.75 58.42,30.48 69.22,30.48 73.03,26.67 92.07,26.67 94.62,24.13 IC1.69
TX  (via drill 0.35)
  Top 0.508: v51.43,8.25 54.61,5.08 IC1.8
  Bottom 0.508: BT_MODULE.3 3.18,43.81 3.18,11.43 25.4,11.43 26.67,12.7 31.75,12.7 33.65,10.8 33.65,8.25 v51.43,8.25

### Text on the board
tPlace: SIG + -
tNames: Marko Koren 4.TM | V1.0